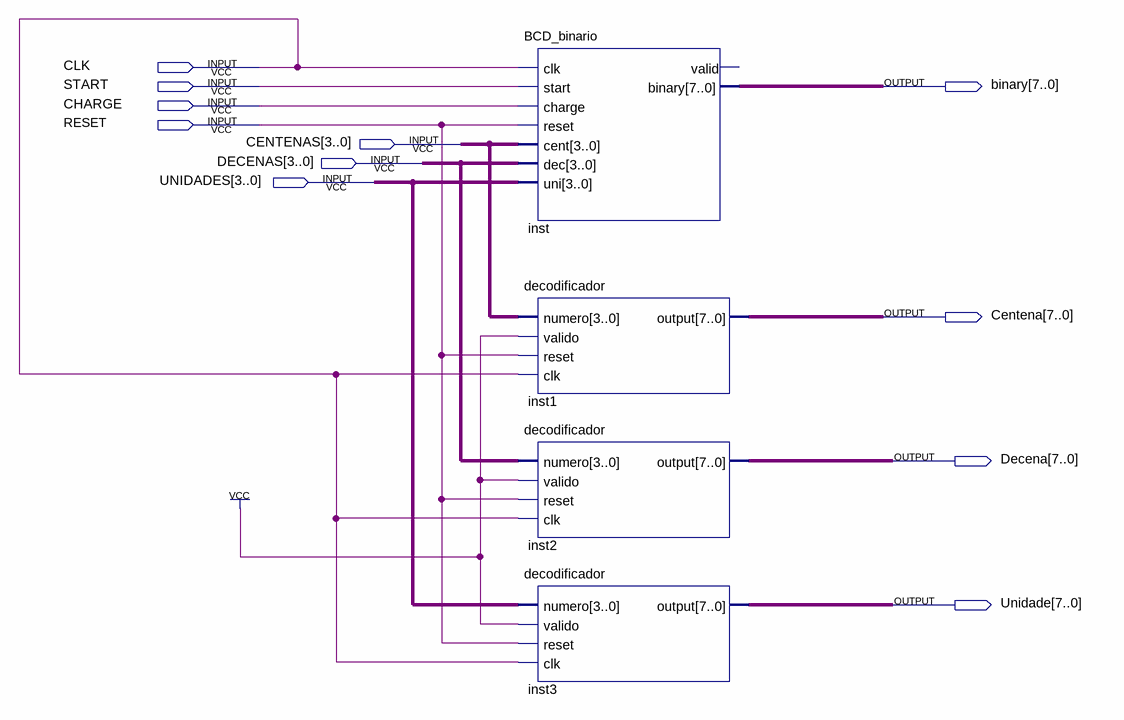
[diagram p0: schematic sheet]
// Quartus schematic Block1.bdf as structural Verilog: 4 symbols, 11 pins
module Block1 (
  input  CLK,
  input  START,
  input  CHARGE,
  input  RESET,
  input  [3:0] CENTENAS,
  input  [3:0] DECENAS,
  input  [3:0] UNIDADES,
  output [7:0] binary,
  output [7:0] Centena,
  output [7:0] Decena,
  output [7:0] Unidade
);

  BCD_binario inst (
    .clk(CLK), .start(START), .charge(CHARGE), .reset(RESET), .cent(CENTENAS), .dec(DECENAS), .uni(UNIDADES),
    .binary(binary));  // open: valid
  decodificador inst1 (.numero(CENTENAS), .valido(1'b1), .reset(RESET), .clk(CLK), .\output (Centena));
  decodificador inst2 (.numero(DECENAS), .valido(1'b1), .reset(RESET), .clk(CLK), .\output (Decena));
  decodificador inst3 (.numero(UNIDADES), .valido(1'b1), .reset(RESET), .clk(CLK), .\output (Unidade));
endmodule
